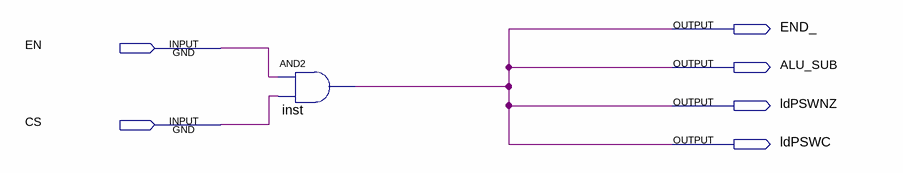
[diagram p0: schematic sheet]
// Quartus schematic CMP.bdf as structural Verilog: 1 symbols, 6 pins
module CMP (
  input  EN,
  input  CS,
  output END_,
  output ALU_SUB,
  output ldPSWNZ,
  output ldPSWC
);

  and inst (ALU_SUB, EN, CS);

  assign END_ = ALU_SUB;
  assign ldPSWC = ALU_SUB;
  assign ldPSWNZ = ALU_SUB;
endmodule
